# Altium schematic sheet Buck and LDO.SchDoc
size A; SheetNumber: 2; SheetTotal: 8
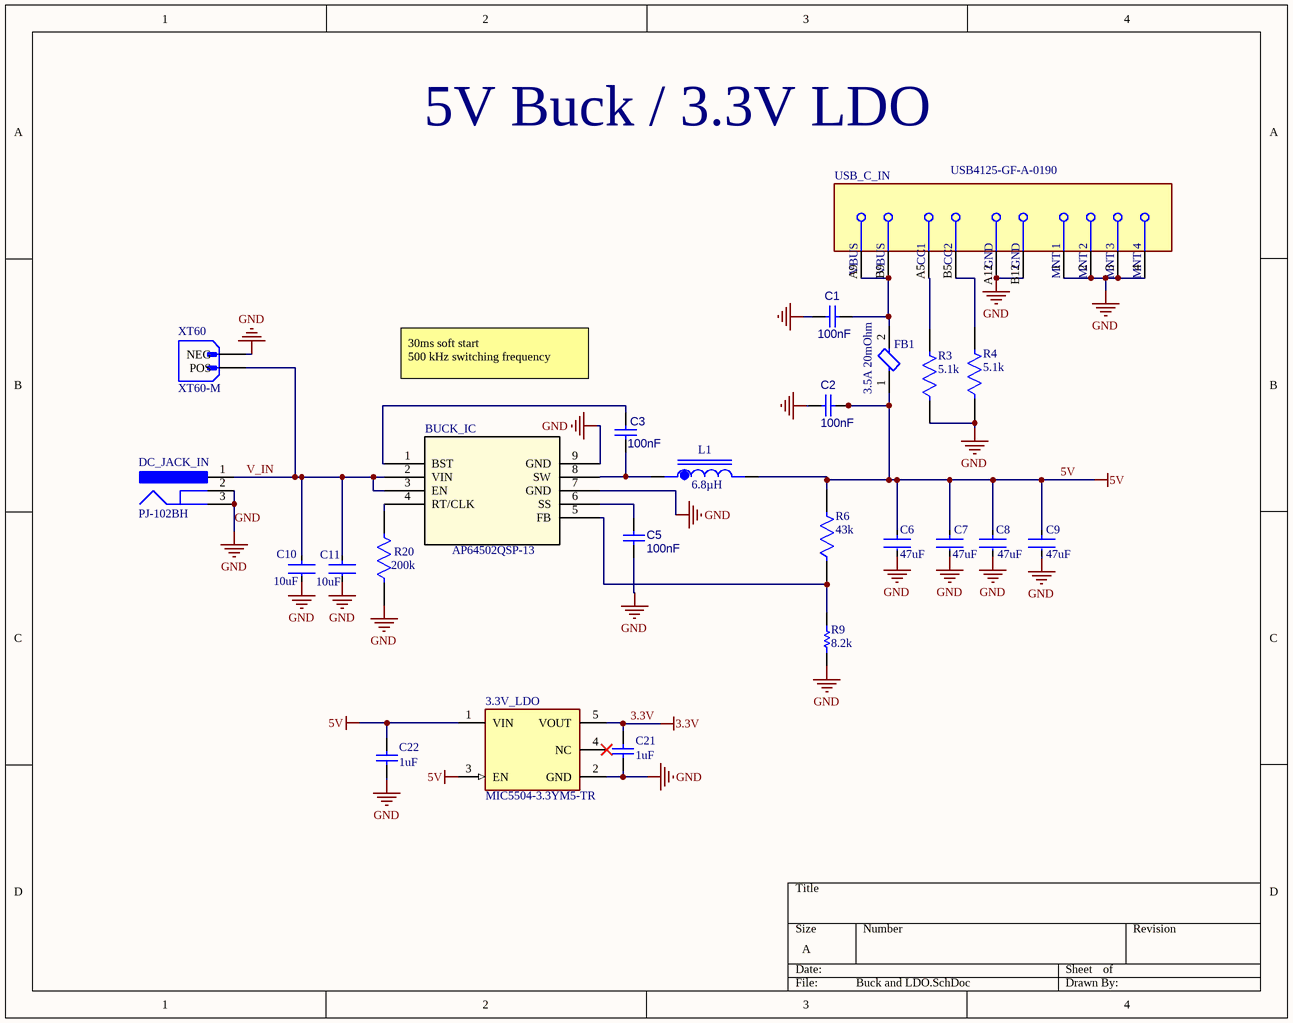
[diagram p0: Buck and LDO.SchDoc]

## Parts
3.3V_LDO  MIC5504-3.3YM5-TR  [FP-SOT23-5LD-PL-1-MFG]
BUCK_IC  AP64502QSP-13  [SO-8EP_DIO]
C1  100nF  [CAPC2013X95X50LL10T25]
C2  100nF  [CAPC2013X95X50LL10T25]
C3  100nF  [CAPC2013X95X50LL10T25]
C5  100nF  [CAPC2013X95X50LL10T25]
C6  47uF  [FP-GRM31C-0_2-e0_3_0_8-IPC_C]
C7  47uF  [FP-GRM31C-0_2-e0_3_0_8-IPC_C]
C8  47uF  [FP-GRM31C-0_2-e0_3_0_8-IPC_C]
C9  47uF  [FP-GRM31C-0_2-e0_3_0_8-IPC_C]
C10  10uF  [FP-CL31-IPC_C]
C11  10uF  [FP-CL31-IPC_C]
C21  1uF  [CAPC3216X180X50ML20T25]
C22  1uF  [CAPC3216X180X50ML20T25]
DC_JACK_IN  PJ-102BH  [CUI-PJ-102BH_V]
FB1  3.5A 20mOhm  [FP-BLM31-0_2-t1_1-MFG]
L1  value 6.8µH  [IND_MGAH06036R8M-10]  (hidden comment: MGAH06036R8M-10)
R3  5.1k  [FP-MCT0603-IPC_B]
R4  5.1k  [FP-MCT0603-IPC_B]
R6  43k  [FP-MCU0805-IPC_C]
R9  8.2k  [RESC0805(2012)_N]
R20  200k  [FP-CRCW0603-HPe3-MFG]
USB_C_IN  USB4125-GF-A-0190  [FP-USB4125-GF-A-0190-MFG]
XT60  XT60-M  [AMASS_XT60-M]

## Nets
3.3V: 3.3V_LDO.5(VOUT) C21.2
5V: 3.3V_LDO.1(VIN) 3.3V_LDO.3(EN) C2.2 C6.1 C7.1 C8.1 C9.1 C22.2 FB1.1 L1.2 R6.2
GND: 3.3V_LDO.2(GND) BUCK_IC.7(GND) BUCK_IC.9(GND) C1.1 C2.1 C5.1 C6.2 C7.2 C8.2 C9.2 C10.2 C11.2 C21.1 C22.1 DC_JACK_IN.2 DC_JACK_IN.3 R3.1 R4.1 R9.1 R20.1 USB_C_IN.1(MNT_1) USB_C_IN.2(MNT_2) USB_C_IN.3(MNT_3) USB_C_IN.4(MNT_4) USB_C_IN.A12(GND) USB_C_IN.B12(GND) XT60.N(NEG)
V_IN: BUCK_IC.2(VIN) BUCK_IC.3(EN) C10.1 C11.1 DC_JACK_IN.1 XT60.P(POS)
NetBUCK_IC_1: BUCK_IC.1(BST) C3.2
NetBUCK_IC_4: BUCK_IC.4(RT/CLK) R20.2
NetBUCK_IC_5: BUCK_IC.5(FB) R6.1 R9.2
NetBUCK_IC_6: BUCK_IC.6(SS) C5.2
NetBUCK_IC_8: BUCK_IC.8(SW) C3.1 L1.1
NetC1_2: C1.2 FB1.2 USB_C_IN.A9(VBUS) USB_C_IN.B9(VBUS)
NetR3_2: R3.2 USB_C_IN.A5(CC1)
NetR4_2: R4.2 USB_C_IN.B5(CC2)

Not connected (* = marked no-connect by the designer): 3.3V_LDO 4(NC)*

## Notes on the sheet
- 5V Buck / 3.3V LDO
- 30ms soft start
  500 kHz switching frequency

## Library data of the parts
3.3V_LDO = CMP-2000-07604-2: IC REG LINEAR 3.3V 300MA SOT23-5; Quiescent Current: 38uA; Operating Supply Current: 42uA; Max Input Voltage: 5.5V; Min Input Voltage: 2.5V; Output Type: Fixed; Power Supply Rejection Ratio (PSRR): 60dB; Dropout Voltage: 380mV; Accuracy: 3%; Number of Outputs: 1; Nominal Output Voltage: 3.3V; Max Output Current: 300mA; Length: 2.9mm; Mount: Surface Mount; Width: 1.6mm; Packaging: Tape and Reel; Output Current: 300mA; Min Operating Temperature: -40°C; Max Operating Temperature: 125°C; Height: 1.1mm; Case/Package: SOT-23-5; REACH SVHC: No SVHC; Number of Pins: 5; Output Voltage: 3.3V
BUCK_IC = AP64502QSP-13: Description; Manufacturer_Name: Diodes Inc; Copyright: Copyright (C) 2025 Ultra Librarian. All rights reserved.; Manufacturer_Part_Number: AP64502QSP-13; RefDes: RefDes; Type: Type; Supplier 1: Avnet; Supplier Part Number 1: AP64502QSP-13
C1-C3 C5 = CMP-001-00018-6: Capacitor 100 nF +/-10% 50 V 0805; Voltage Rating: 50V; Tolerance: 10%; Capacitor Type: Ceramic; Value: 100nF; Pins: 2; Max Operating Temperature: 125°C; Min Operating Temperature: -55°C; Mounting Technology: SM; Case/Package: 0805; RoHS Compliant: True
C6-C9 = CMP-2000-05255-3: Chip Multilayer Ceramic Capacitors for General Purpose, 1206, 47uF, X5R, 15%, 20%, 10V; Case/Package: 1206; Radiation Hardening: No; Case Code (Metric): 3216; Max Operating Temperature: 85°C; Capacitance: 47uF; Tolerance: 20%; REACH SVHC: No SVHC; Depth: 1.6mm; Case Code (Imperial): 1206; Termination: SMD/SMT; Voltage Rating (DC): 10V; Package Quantity: 2000; Voltage Rating: 10V; Width: 1.6mm; Lead Free: Lead Free; Voltage: 10V; Packaging: Tape and Reel; Length: 3.2mm; Height: 1.6mm; Number of Pins: 2; Thickness: 0.071inch; Min Operating Temperature: -55°C; Dielectric: X5R; Mount: Surface Mount
C10 C11 = CMP-13271-000016-1: CAP CER 10UF 50V X5R 1206; Manufacturer: Samsung; Manufacturer Part Number: CL31A106KBHNNNE; Tolerance: 10%; Material: Ceramic; Temperature Coefficient: 15%; RoHS: TRUE; Ipc Land Pattern Name: CAPC320160X160; Temperature Range Low: -55°C; Value: 10uF; Device Class L3: Ceramic Capacitors; Category: Cap; Temperature Characteristic: X5R; Lead Free: Yes; Device Class L2: Capacitors; Octopart: https://octopart.com/cl31a106kbhnnne-samsung-19832778; ComponentLink2Description: Datasheet; Digikey Description: CAP CER 10UF 50V X5R 1206; Voltage: 50V; ComponentLink2URL: http://www.samsungsem.com/kr/support/product-search/mlcc/__icsFiles/afieldfile/2018/06/21/CL31A106KBHNNNE.pdf; Capacitance: 10uF; Temperature Range High: +85°C; Device Class L1: Passive Components; Height: 1.8mm; Automotive: No; Voltage Rating: 50V; Package: CL31; Temperature: -55°C to +85°C
C21 C22 = CMP-2000-04991-1: Chip Capacitor, 1 uF, +/- 10%, 25 V, -55 to 125 degC, 1206 (3216 Metric), RoHS, Tape and Reel; Manufacturer: Kemet; Temperature Coefficient / Code: +/-15%; Dielectric: X7R; Voltage Rating DC: 25V; Capacitance - nF: 1000nF; Class: Class1; Case Length: 3.2mm; Type: SMDMLCCX7R6.3-250VDCCommericalGrade; Case Width: 1.6mm; Product: GeneralTypeMLCCs; Capacitance: 1uF; Datasheet URL: https://ciiva.com/datasheet-click-18194173?src=ciiva&sig=6daff8c4; Operating Temperature Range: -55Cto+125C; Series: C1206C; RoHS: Details; Product Category: MultilayerCeramicCapacitorsMLCC-SMD/SMT; Manufacturer URL: http://www.kemet.com/; Minimum Operating Temperature: -55C; Dimensions: 1.6mmWx3.2mmLx1.6mmH; Termination Style: SMD/SMT; Brand: Kemet; Packaging: Reel; Package / Case: 1206(3216metric); Case Code - mm: 3216; Datasheet Version: Jul-14; Factory Pack Quantity: 2000; Package Description: 2-Pin Surface Mount Device, Body 3.2 x 1.6 mm; Tolerance: 10%; Package Reference: 1206; Case Height: 1.6mm; Case Code - in: 1206; Maximum Operating Temperature: +125C; Voltage Rating: 25V
DC_JACK_IN = CMP-2000-06901-1: Through Hole Right Angle DC Power Jack, 5 A, 2.5 mm Center Pin, 3 Position, -25 to 85 degC, RoHS, Bulk; Manufacturer: CUIInc.; Outside Contact Diameter: 6.5mm; Current Rating: 5A; Brand: CUI; Insulation Resistance: 100MOhms; Inside Contact Diameter: 2.5mm; Voltage Rating: 24V; Operating Temperature Range: -25Cto+85C; Mounting Angle: Right; Mounting Technology: ThroughHole; Product Category: DCPowerConnectors; Datasheet Version: Rev. 1.02, 05/2016; Connector Type: DCPowerJack; Contact Material: Copper; Housing Material: PolybutyleneTerephthalate(PBT); Mounting Style: ThroughHole; Product: Jacks; Package Reference: PJ-102BH; Manufacturer URL: http://www.cui.com/; RoHS: True; Contact Gender: Male; Contact Plating: Nickel; Flammability Rating: UL94V-0; Factory Pack Quantity: 280; Datasheet URL: http://www.cui.com/product/resource/pj-102bh.pdf; Package Description: 3-Pin Through Hole Device, Body 14.4 x 9 mm, Height 11 mm; Termination Style: ThroughHole
FB1 = CMP-0686-00732-3: BLM31PG121SN1L Chip Ferrite Bead Array, 1206, 120Ω @ 100MHz, 0.02Ω, 25%, 3.5A; Number of Lines: 1; DC Current: 3A; Impedance: 120R; Material: Steel; DC Resistance (DCR): 20mR; Shielding: Unshielded; Number of Pins: 2; Case Code (Metric): 3216; Contact Plating: Tin; Radiation Hardening: No; Termination: SMD/SMT; Lead Free: Lead Free; Core Material: Ferrite; Case Code (Imperial): 1206; Test Frequency: 100MHz; Depth: 1.6mm; Max Operating Temperature: 125°C; Package Quantity: 3000; Packaging: Tape and Reel; Min Operating Temperature: -55°C; Length: 3.2mm; Current Rating: 3.5A; RoHS Compliant: Yes; Tolerance: 25%; Width: 1.6mm; Max Current Rating: 3.5A; Frequency: 100MHz; Military Standard: Not; Case/Package: 1206; Max DC Current: 3A; Height: 1.1mm
L1 = CMP-006-00023-1: 6.8 ÂµH Shielded Molded Inductor 5 A 50mOhm Max Nonstandard; MF: Laird-Signal Integrity Products; SnapEDA_Link: https://www.snapeda.com/parts/MGAH06036R8M-10/Laird/view-part/?ref=snap; Price: None; Availability: In Stock; Pins: 2; Design Item ID: MGAH06036R8M-10; Check_prices: https://www.snapeda.com/parts/MGAH06036R8M-10/Laird/view-part/?ref=eda; Component Type: Standard; Case/Package: None; Purchase-URL: https://pricing.snapeda.com/search/part/MGAH06036R8M-10/?ref=eda; MP: MGAH06036R8M-10; Source: MGAH06036R8M-10.SchLib
R3 R4 = CMP-02407-010205-1: MCT06030D5101BP500 RES SMD 5100 OHM 1% 1/8W 0603; Resistance: 5.1kR; Tolerance: 0.1%; Temperature Coefficient: 25ppm/°C; Max Operating Temperature: 125°C; Radiation Hardening: No; Composition: Thin Film; Height: 450um; Lead Free: Lead Free; Contact Plating: Tin; Length: 1.55mm; Width: 850um; Case/Package: 0603; Min Operating Temperature: -55°C
R6 = CMP-02407-010835-1: MCU08050C4302FP500 RES 1.05K OHM 0.5% 1/5W 0805; Tolerance: 1%; Resistance: 43000R; Height: 450um; Lead Free: Lead Free; Length: 2mm; Case/Package: 0805; Width: 1.25mm
R9 = CMP-1013-00613-1: 8K2 0.125W 1% 0805 (2012 Metric)  SMD; Value: 8200.00 Ohm; Case-EIA: 0805; Case-Metric: 2012; Power: 0.125 W; Tolerance: 1 %; Technology: SMT
R20 = CMP-02407-007717-1: RES Thick Film, 200kΩ, 1%, 0.33W, 100ppm/°C, 0603; Resistance: 200kR; Max Power Dissipation: 250mW; Tolerance: 1%; Composition: Thick Film; Features: Automotive AEC-Q200; Min Operating Temperature: -55°C; Case/Package: 0603; Length: 0.063inch; Max Operating Temperature: 155°C; Number of Terminations: 2; Height: 0.022inch; Military Standard: Not; Package Quantity: 5000; Width: 0.033inch; Temperature Coefficient: 100ppm/°C; Lead Free: Lead Free; Packaging: Tape and Reel; Depth: 0.85mm
USB_C_IN = CMP-245163-000004-1: CONN RCPT TYPE C 6P SMD RA
XT60 = CMP-002-00073-1: Plug; DC supply; XT60; male; PIN: 2; for cable; soldered; 30A; 500V; MF: AMASS; Design Item ID: XT60-M; Component Type: Standard; Case/Package: Package; MP: XT60-M; Value: *; Pins: 2; Check_prices: https://www.snapeda.com/parts/XT60-M/AMASS/view-part/?ref=eda; Source: XT60-M.SchLib; SnapEDA_Link: https://www.snapeda.com/parts/XT60-M/AMASS/view-part/?ref=snap